# EAGLE design skmagiik_thing (EAGLE 6.5.0)
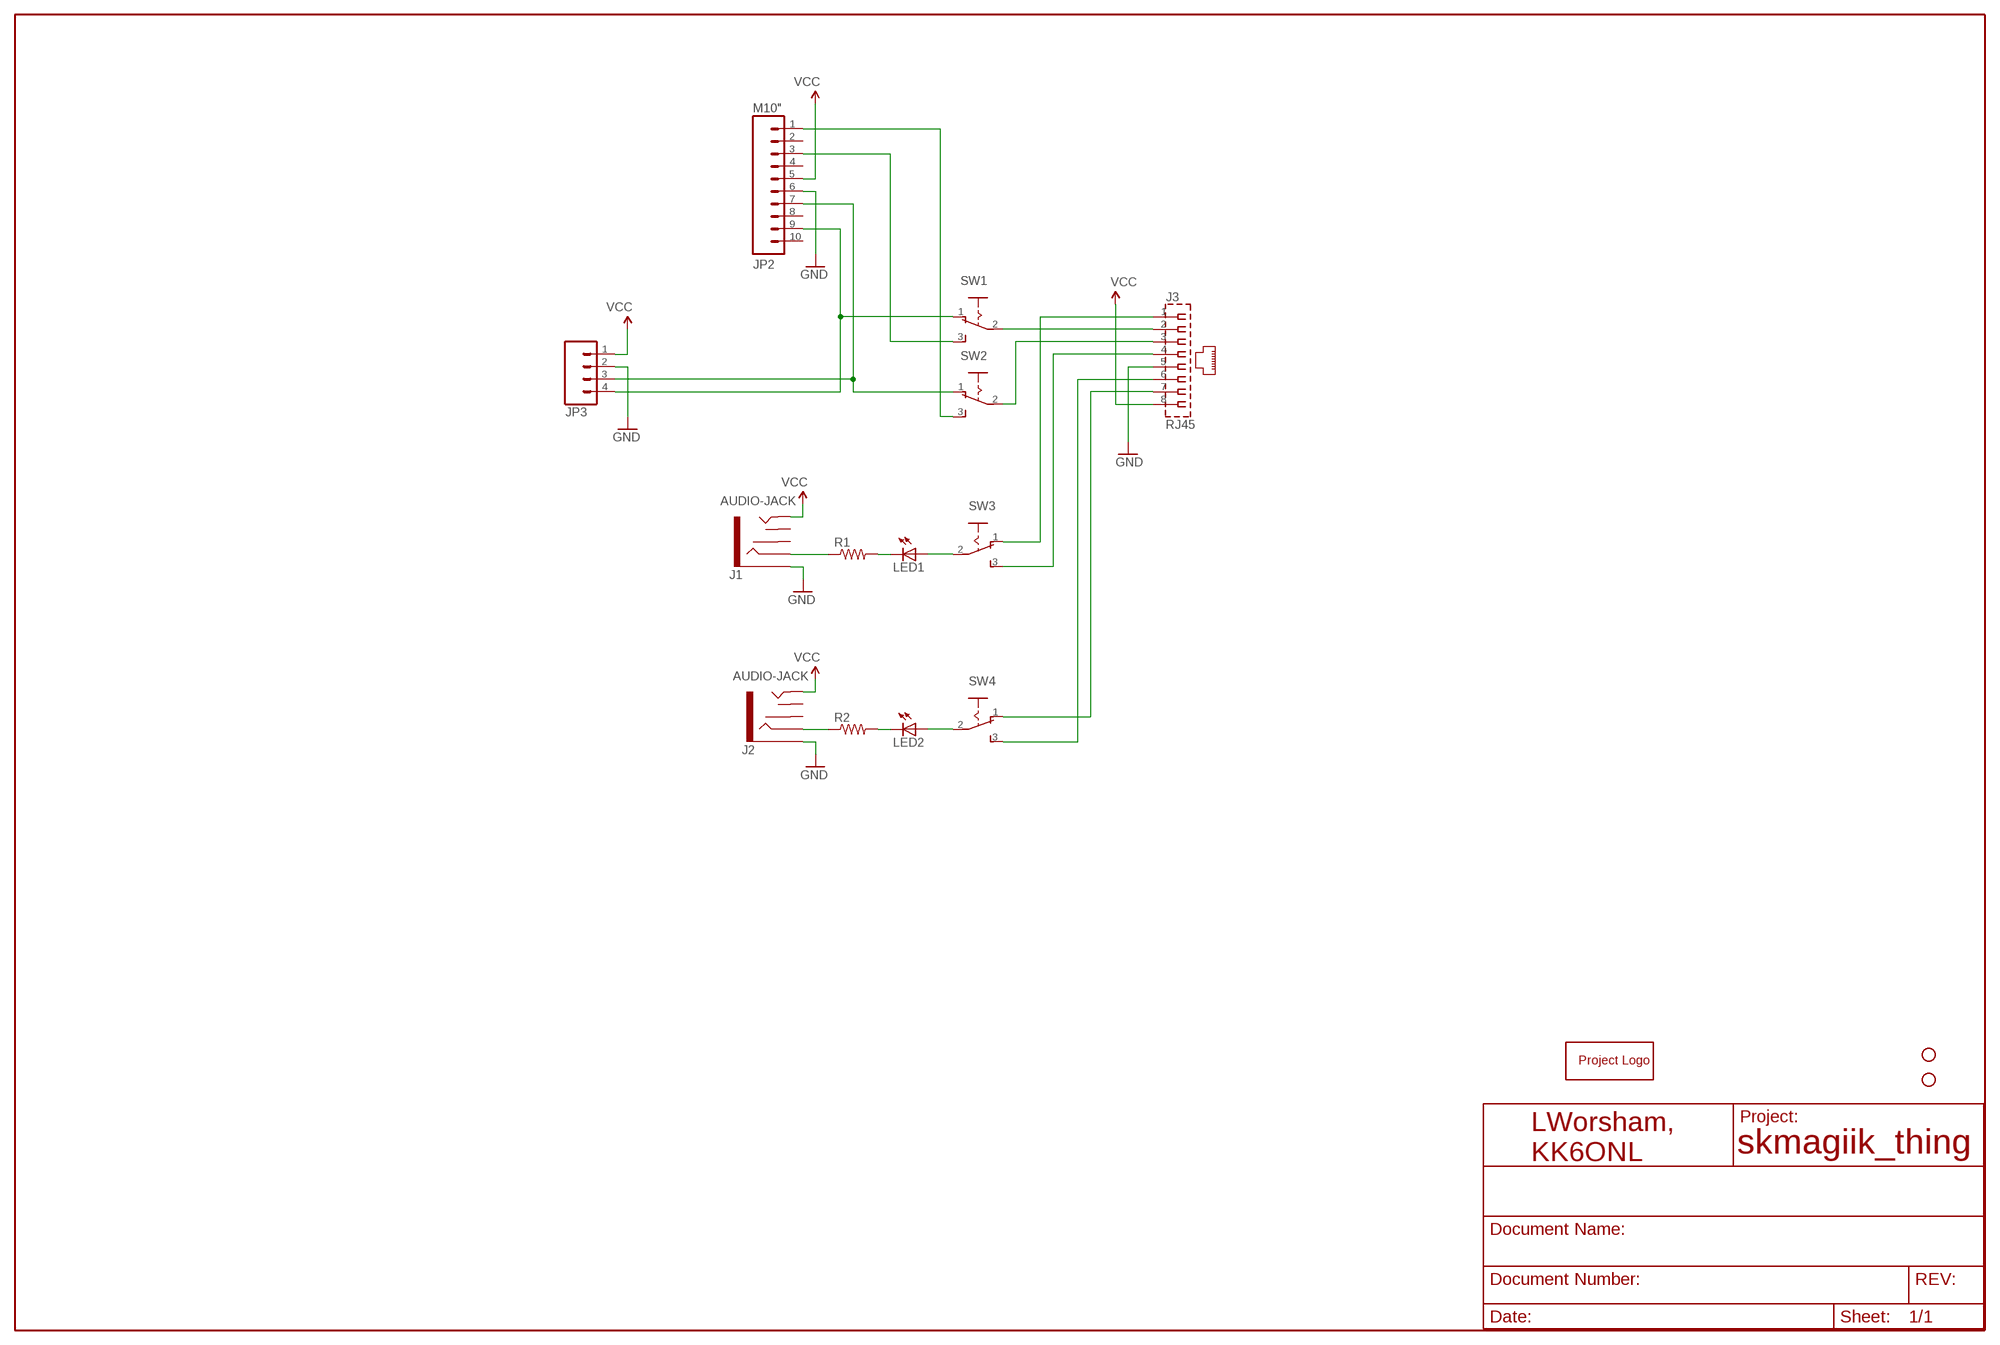
[diagram p0: schematic, sheet 1]

## Parts
J1  AUDIO-JACK  AUDIO-JACK2PTH  [AUDIO-JACK]
J2  AUDIO-JACK  AUDIO-JACK2PTH  [AUDIO-JACK]
J3  RJ45  [RJ45]
JP2  M10"  [1X10]
JP3  M04PTH  [1X04]
LED1  LED3MM  [LED3MM]
LED2  LED3MM  [LED3MM]
R1  R-US_0207/10  [0207/10]
R2  R-US_0207/10  [0207/10]
STANDOFF3  STAND-OFF  [STAND-OFF]
STANDOFF5  STAND-OFF  [STAND-OFF]
SW1  M251  [M251]
SW2  M251  [M251]
SW3  M251  [M251]
SW4  M251  [M251]
U$2  PROJECT_LOGO  [BMP_TEST]

## Nets
GND: J1.SLEEVE J2.SLEEVE J3.5 JP2.6 JP3.2
N$1: J2.RING R2.1
N$2: J1.RING R1.1
N$3: J3.7 SW4.1(O)
N$4: J3.6 SW4.3(S)
N$5: J3.4 SW3.3(S)
N$6: J3.1 SW3.1(O)
N$7: LED2.A SW4.2(P)
N$8: LED1.A SW3.2(P)
N$9: JP2.7 JP3.3 SW2.1(O)
N$10: JP2.1 SW2.3(S)
N$11: JP2.9 JP3.4 SW1.1(O)
N$12: LED1.K(C) R1.2
N$13: JP2.3 SW1.3(S)
N$14: LED2.K(C) R2.2
N$17: J3.2 SW1.2(P)
N$18: J3.3 SW2.2(P)
VCC: J1.TIP J2.TIP J3.8 JP2.5 JP3.1
Unconnected: J1.RSH J1.TSH J2.RSH J2.TSH JP2.2 JP2.4 JP2.8 JP2.10

## Library data of the parts
J1 J2 = SparkFun:AUDIO-JACK2
J3 = pjb:RJ45
JP2 = SparkFun-Connectors:M10: Header 10 Standard 10-pin 0.1" header. Use with straight break away headers (SKU : PRT-00116), right angle break away headers (PRT-00553), swiss pins (PRT-00743), machine pins (PRT-00117), and female headers (PRT-00115).; NO_PART: 1
JP3 = SparkFun:M04: Header 4 Standard 4-pin 0.1" header. Use with straight break away headers (SKU : PRT-00116), right angle break away headers (PRT-00553), swiss pins (PRT-00743), machine pins (PRT-00117), and female headers (PRT-00115). Molex polarized connector foot print use with SKU : PRT-08231 with associated crimp pins and housings.
LED1 LED2 = led:LED: LED OSRAM: - CHIPLED LG R971, LG N971, LY N971, LG Q971, LY Q971, LO R971, LY R971 LH N974, LH R974 LS Q976, LO Q976, LY Q976 LO Q996 - Hyper CHIPLED LW Q18S LB Q993, LB Q99A, LB R99A - SideLED LS A670, LO A670, LY A670, LG A670, LP A670 LB A673, LV A673, LT A673, LW A673 LH A674 LY A675 LS A676, LA A676, LO A676, LY A676, LW A676 LS A679, LY A679, LG A679 - Hyper Micro SIDELED® LS Y876, LA Y876, LO Y876, LY Y876 LT Y87S - SmartLED LW L88C, LW L88S LB L89C, LB L89S, LG L890 LS L89K, LO L89K, LY L89K LS L896, LA L896, LO L896, LY L896 - TOPLED LS T670, LO T670, LY T670, LG T670, LP T670 LSG T670, LSP T670, LSY T670, LOP T670, LYG T670 LG T671, LOG T671, LSG T671 LB T673, LV T673, LT T673, LW T673 LH T674 LS T676, LA T676, LO T676, LY T676, LB T676, LH T676, LSB T676, LW T676 LB T67C, LV T67C, LT T67C, LS T67K, LO T67K, LY T67K, LW E67C LS E67B, LA E67B, LO E67B, LY E67B, LB E67C, LV E67C, LT E67C LW T67C LS T679, LY T679, LG T679 LS T770, LO T770, LY T770, LG T770, LP T770 LB T773, LV T773, LT T773, LW T773 LH T774 LS E675, LA E675, LY E675, LS T675 LS T776, LA T776, LO T776, LY T776, LB T776 LHGB T686 LT T68C, LB T68C - Hyper Mini TOPLED® LB M676 - Mini TOPLED Santana® LG M470 LS M47K, LO M47K, LY M47K Source: http://www.osram.convergy.de LUXEON: - LUMILED® LXK2-PW12-R00, LXK2-PW12-S00, LXK2-PW14-U00, LXK2-PW14-V00 LXK2-PM12-R00, LXK2-PM12-S00, LXK2-PM14-U00 LXK2-PE12-Q00, LXK2-PE12-R00, LXK2-PE12-S00, LXK2-PE14-T00, LXK2-PE14-U00 LXK2-PB12-K00, LXK2-PB12-L00, LXK2-PB12-M00, LXK2-PB14-N00, LXK2-PB14-P00, LXK2-PB14-Q00 LXK2-PR12-L00, LXK2-PR12-M00, LXK2-PR14-Q00, LXK2-PR14-R00 LXK2-PD12-Q00, LXK2-PD12-R00, LXK2-PD12-S00 LXK2-PH12-R00, LXK2-PH12-S00 LXK2-PL12-P00, LXK2-PL12-Q00, LXK2-PL12-R00 Source: www.luxeon.com KINGBRIGHT: KA-3528ASYC Source: www.kingbright.com
R1 R2 = resistor:R-US_: RESISTOR, American symbol
STANDOFF3 STANDOFF5 = SparkFun-Electromechanical:STAND-OFF: #4 Stand Off This is the mechanical footprint for a #4 phillips button head screw. Use the keepout ring to avoid running the screw head into surrounding components. SKU : PRT-00447
SW1-SW4 = switch:M251: SLIDING SWITCH Mors, distributor Buerklin, 11G702
U$2 = links_misc:PROJECT_LOGO

## Net classes
0 default: width 0.203 mm

## Board
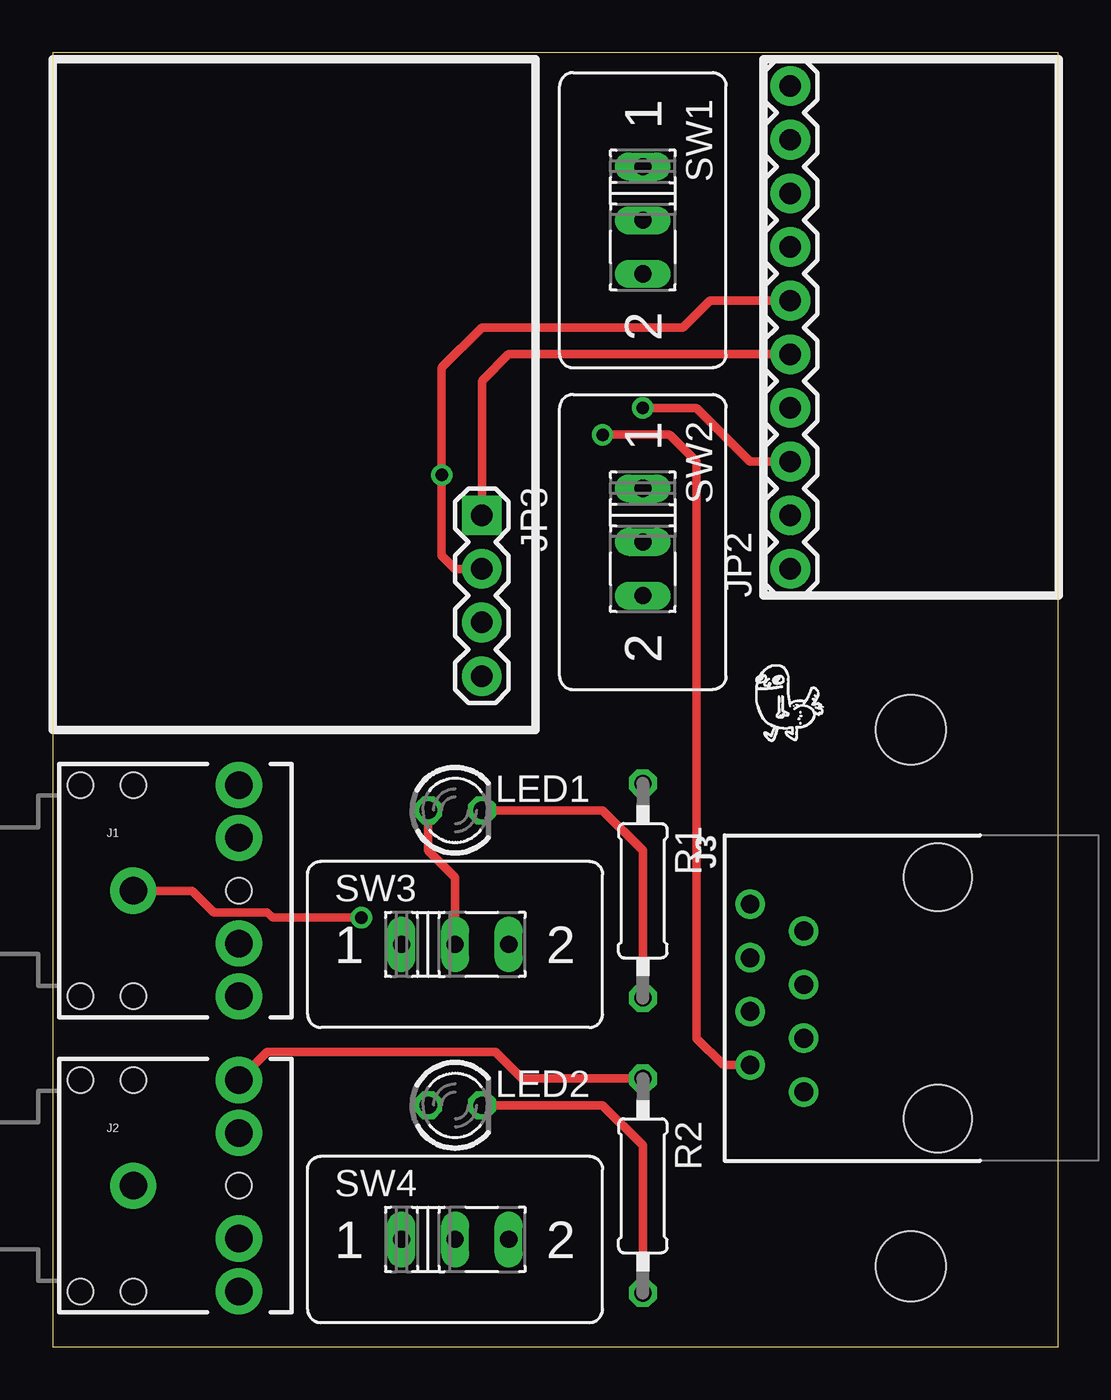
[diagram p1: board, top side]
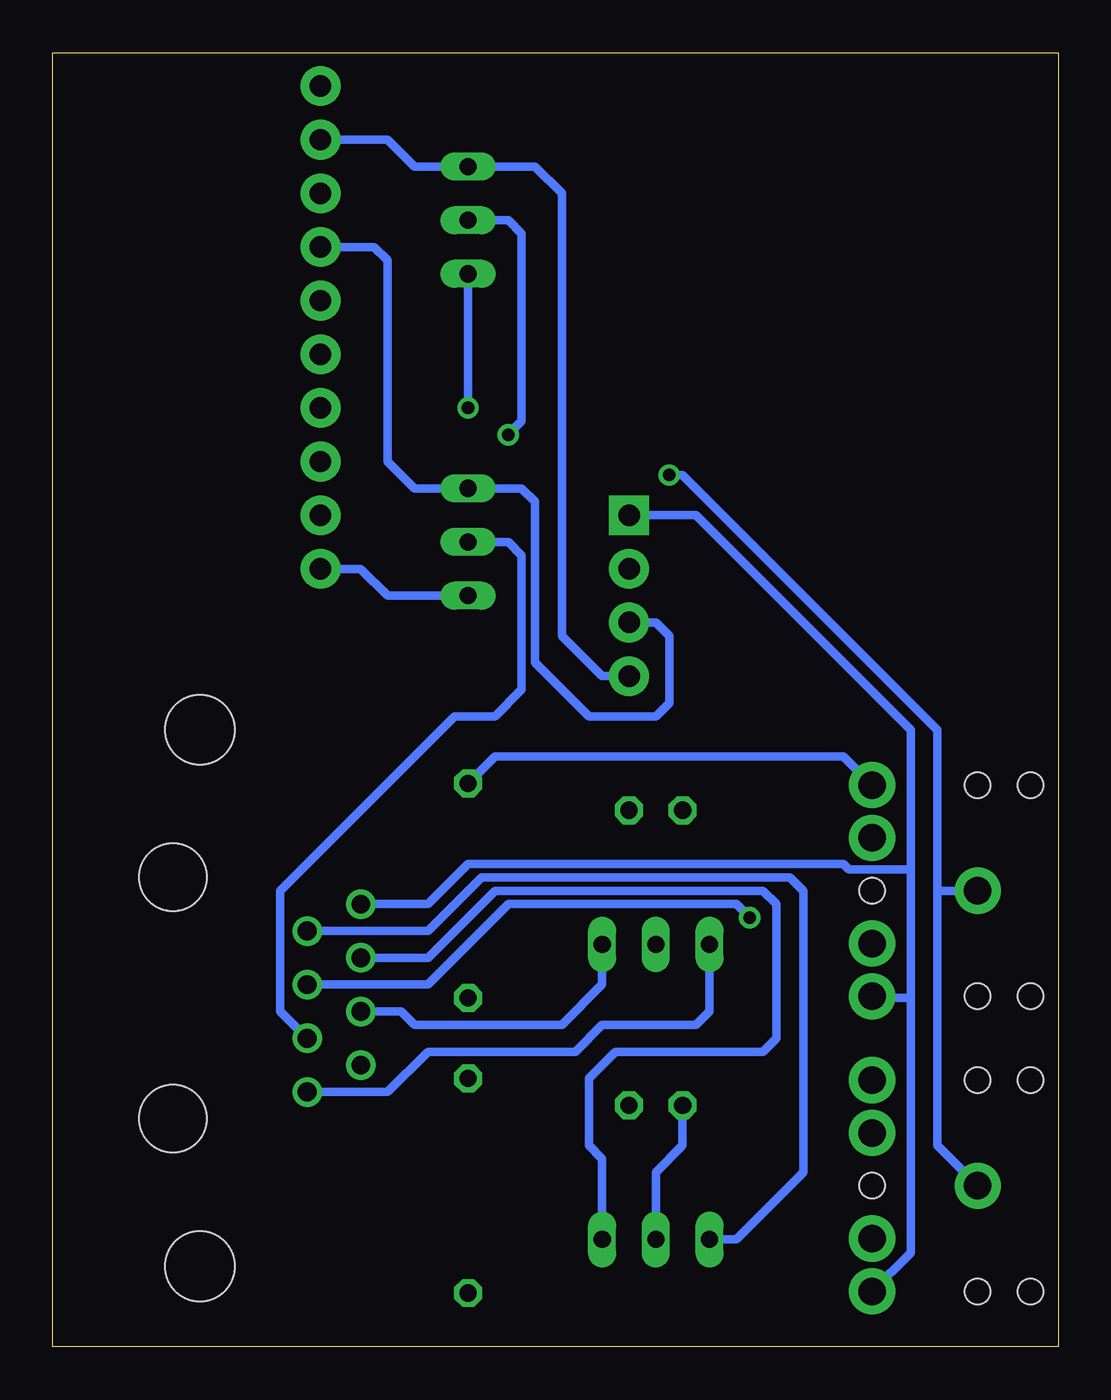
[diagram p2: board, bottom side, seen from below]

Size 47.6 x 61.27 mm. Coordinates in mm from the lower left corner, seen from the top.
Outline: 0,0 47.6,0 47.6,61.27 0,61.27 0,0
Copper layers (1*16): Top 0.035mm / dielectric 1.5mm / Bottom 0.035mm
Design rules "default": minimum track width 10mil, minimum drill 24mil, track to track 8mil, track to pad 8mil, pad to pad 8mil, via to via 8mil, smd to smd 8mil, copper to edge 40mil, drill to drill 8mil, minimum pad ring 10mil, minimum via ring 8mil, stop-mask expansion 4mil, vias tented up to drill 0mil, thermal gap 10mil

### Footprints (pad centres in the part's own frame; a part is rotated, then mirrored left to right if it is on the bottom)
AUDIO-JACK = drill 1.3 pad 2.184: RING 5,5; RSH 5,2.5; SLEEVE 0,0; TIP 5,-5; TSH 5,-2.5 | hole 1.2: 0,5; -2.5,5; -2.5,-5; 0,-5; 5,0
RJ45 = drill 0.89: 1 4.445,-6.35; 2 3.175,-8.89; 3 1.905,-6.35; 4 0.635,-8.89; 5 -0.635,-6.35; 6 -1.905,-8.89; 7 -3.175,-6.35; 8 -4.445,-8.89 | hole 3.2: -5.715,0; 5.715,0
1X10 = drill 1.016 pad 1.88: 1 0,0; 2 2.54,0; 3 5.08,0; 4 7.62,0; 5 10.16,0; 6 12.7,0; 7 15.24,0; 8 17.78,0; 9 20.32,0; 10 22.86,0
1X04 = drill 1.016 pad 1.88 square: 1 0,0 | drill 1.016 pad 1.88: 2 2.54,0; 3 5.08,0; 4 7.62,0
LED3MM = drill 0.813 octagon: A -1.27,0; K 1.27,0
0207/10 = drill 0.813 octagon: 1 -5.08,0; 2 5.08,0
STAND-OFF = hole 3.302: 0,0
M251 = drill 0.813 long: 1 -2.54,0; 2 0,0; 3 2.54,0

### Placement (x,y rotation side)
J1  3.81,21.59 0 top
J2  3.81,7.62 0 top
J3  41.91,16.51 270 top
JP2  34.92,36.83 90 top
JP3  20.32,39.37 270 top
LED1  19.05,25.4 0 top
LED2  19.05,11.43 0 top
R1  27.94,21.59 270 top
R2  27.94,7.62 270 top
STANDOFF3  40.64,3.81 0 top
STANDOFF5  40.64,29.21 0 top
SW1  27.94,53.34 270 top
SW2  27.94,38.1 270 top
SW3  19.05,19.05 0 top
SW4  19.05,5.08 0 top
U$2  32.38,27.94 0 top

### Tracks (layer width: path | path; a pad name or v marks a point on that pad's centre or on a via)
GND  (via drill 0.6)
  Top 0.406: v14.61,20.32 10.41,20.32 10.16,20.57 7.62,20.57 6.6,21.59 J1.SLEEVE | JP2.6 31.11,49.53 29.84,48.26 20.32,48.26 18.41,46.35 v18.41,41.27 18.41,37.47 19.05,36.83 JP3.2
  Bottom 0.406: J2.SLEEVE 5.71,9.53 5.71,21.59 | 5.71,21.59 5.71,29.21 17.78,41.27 v18.41,41.27 | J3.5 29.84,17.14 26.04,20.95 15.24,20.95 v14.61,20.32 | J1.SLEEVE 5.71,21.59
N$1
  Top 0.406: J2.RING 10.16,13.97 20.95,13.97 22.23,12.7 R2.1
N$2
  Bottom 0.406: J1.RING 10.16,27.94 26.67,27.94 R1.1
N$3
  Bottom 0.406: J3.7 29.84,19.68 27.3,22.23 12.7,22.23 12.06,21.59 12.06,8.26 15.24,5.08 SW4.1
N$4
  Bottom 0.406: J3.6 29.84,18.41 26.67,21.59 13.97,21.59 13.34,20.95 13.34,14.61 13.97,13.97 20.95,13.97 22.23,12.7 22.23,9.53 21.59,8.89 SW4.3
N$5
  Bottom 0.406: SW3.3 21.59,17.14 23.5,15.24 30.48,15.24 31.11,15.88 J3.4
N$6
  Bottom 0.406: SW3.1 16.51,15.88 17.14,15.24 21.59,15.24 22.86,13.97 29.84,13.97 31.75,12.06 J3.1
N$7
  Bottom 0.406: LED2.A 17.78,9.53 19.05,8.26 SW4.2
N$8
  Top 0.406: LED1.A 17.78,23.5 19.05,22.23 SW3.2
N$9
  Bottom 0.406: JP2.7 32.38,52.07 31.75,51.44 31.75,41.91 30.48,40.64 SW2.1 25.4,40.64 24.77,40.01 24.77,32.38 22.23,29.84 19.05,29.84 18.41,30.48 18.41,33.66 19.05,34.29 JP3.3
N$10
  Bottom 0.406: SW2.3 31.75,35.56 33.02,36.83 JP2.1
N$11
  Bottom 0.406: JP2.9 31.75,57.15 30.48,55.88 SW1.1 24.77,55.88 23.5,54.61 23.5,33.66 21.59,31.75 JP3.4
N$12
  Top 0.406: R1.2 27.94,23.5 26.04,25.4 LED1.K
N$13  (via drill 0.6)
  Top 0.406: v27.94,44.45 30.48,44.45 33.02,41.91 JP2.3
  Bottom 0.406: SW1.3 v27.94,44.45
N$14
  Top 0.406: R2.2 27.94,9.53 26.04,11.43 LED2.K
N$17  (via drill 0.6)
  Top 0.406: v26.04,43.18 29.21,43.18 30.48,41.91 30.48,14.61 31.75,13.34 J3.2
  Bottom 0.406: SW1.2 26.04,53.34 25.4,52.7 25.4,43.81 v26.04,43.18
N$18
  Bottom 0.406: J3.3 36.83,15.88 36.83,21.59 28.57,29.84 26.67,29.84 25.4,31.11 25.4,37.47 26.04,38.1 SW2.2
VCC
  Top 0.406: JP2.5 21.59,46.99 20.32,45.72 JP3.1
  Bottom 0.406: J2.TIP 6.99,4.45 6.99,16.51 | J3.8 29.84,20.95 27.94,22.86 10.16,22.86 9.91,22.61 6.99,22.61 | 6.99,16.51 6.99,22.61 | 6.99,22.61 6.99,29.21 17.14,39.37 JP3.1 | J1.TIP 8.73,16.51 6.99,16.51